# EAGLE design Bus_BoardV1.1 (EAGLE 5.06)
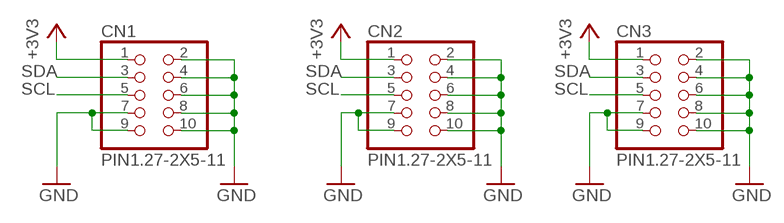
[diagram p0: schematic, sheet 1]

## Parts
CN1  PIN1.27-2X5-11  [2X05-TH1.27MM-LC]
CN2  PIN1.27-2X5-11  [2X05-TH1.27MM-LC]
CN3  PIN1.27-2X5-11  [2X05-TH1.27MM-LC]

## Nets
+3V3: CN1.1 CN2.1 CN3.1
GND: CN1.2 CN1.4 CN1.6 CN1.7 CN1.8 CN1.9 CN1.10 CN2.2 CN2.4 CN2.6 CN2.7 CN2.8 CN2.9 CN2.10 CN3.2 CN3.4 CN3.6 CN3.7 CN3.8 CN3.9 CN3.10
SCL: CN1.5 CN2.5 CN3.5
SDA: CN1.3 CN2.3 CN3.3

## Library data of the parts
CN1-CN3 = my_lib:PIN1.27-2X5-: HARWIN Female-to-Male IDC Ribbon Cable Assembly 1.27mm Pitch DIL 10 Contacts, 2 rows

## Board
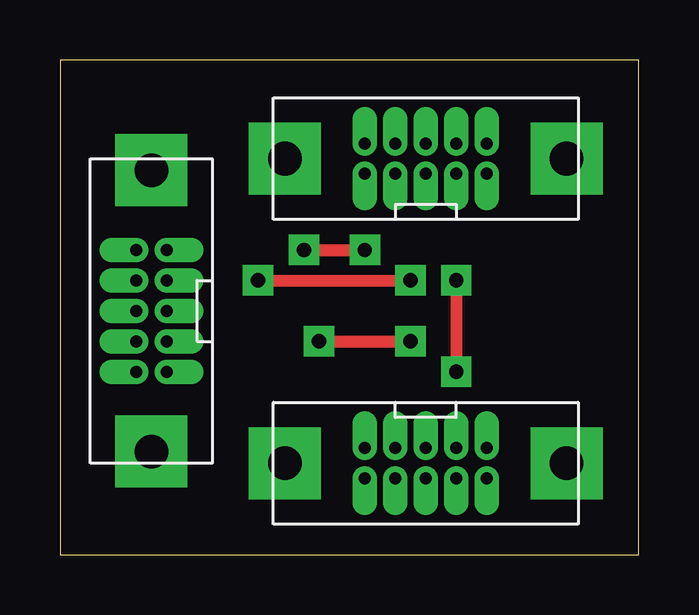
[diagram p1: board, top side]
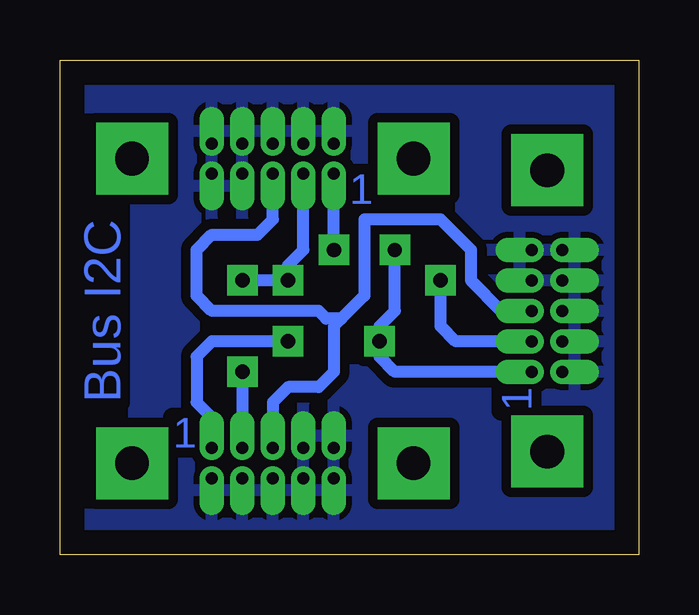
[diagram p2: board, bottom side, seen from below]

Size 24.11 x 20.62 mm. Coordinates in mm from the lower left corner, seen from the top.
Outline: 0,0 24.11,0 24.11,20.62 0,20.62 0,0
Copper layers (1*16): Top 0.035mm / dielectric 1.5mm / Bottom 0.035mm
Design rules "default": minimum track width 10mil, minimum drill 24mil, track to track 8mil, track to pad 8mil, pad to pad 8mil, via to via 8mil, smd to smd 8mil, copper to edge 40mil, drill to drill 8mil, minimum pad ring 10mil, minimum via ring 8mil, stop-mask expansion 4mil, vias tented up to drill 0mil, thermal gap 10mil

### Footprints (pad centres in the part's own frame; a part is rotated, then mirrored left to right if it is on the bottom)
2X05-TH1.27MM-LC = drill 0.5 pad 1.016 offset: 1 -2.54,-0.635; 2 -2.54,0.635; 3 -1.27,-0.635; 4 -1.27,0.635; 5 0,-0.635; 6 0,0.635; 7 1.27,-0.635; 8 1.27,0.635; 9 2.54,-0.635; 10 2.54,0.635 | drill 1.4 pad 3 square: P$11 -5.867,0; P$12 5.867,0

### Placement (x,y rotation side)
CN1  3.81,10.16 90 top
CN2  15.24,16.51 0 top
CN3  15.24,3.81 180 top

### Tracks (layer width: path | path; a pad name or v marks a point on that pad's centre or on a via)
+3V3  (via drill 0.6 pad 1.27)
  Top 0.508: v10.79,8.89 v14.61,8.89 | v10.16,12.7 v12.7,12.7
  Bottom 0.508: CN3.1 17.78,5.71 18.41,6.35 18.41,8.26 17.78,8.89 v14.61,8.89 | v12.7,12.7 CN2.1 | CN1.1 10.16,7.62 10.79,8.26 v10.79,8.89 10.79,9.53 10.16,10.16 v10.16,12.7
GND
  pour Bottom (isolate 0.406): 0,20.32 24.13,20.32 24.13,0 0,0
SCL
  Bottom 0.508: CN3.5 15.24,6.35 14.61,6.99 13.34,6.99 12.7,7.62 12.7,9.53 12.38,9.84 | 12.38,9.84 13.02,9.84 13.34,10.16 17.78,10.16 18.41,10.79 18.41,12.7 17.78,13.34 15.88,13.34 15.24,13.97 CN2.5 | CN1.5 5.71,10.16 6.99,11.43 6.99,12.7 8.26,13.97 11.43,13.97 11.43,10.79 12.38,9.84
SDA  (via drill 0.6 pad 1.27)
  Top 0.508: v8.26,11.43 v14.61,11.43 | v16.51,11.43 v16.51,7.62
  Bottom 0.508: v16.51,7.62 CN3.3 | v16.51,11.43 v14.61,11.43 14.61,12.06 13.97,12.7 CN2.3 | CN1.3 7.62,8.89 8.26,9.53 v8.26,11.43

### Text on the board
Bottom: Bus I2C